# Altium schematic sheet camera.SchDoc
size A
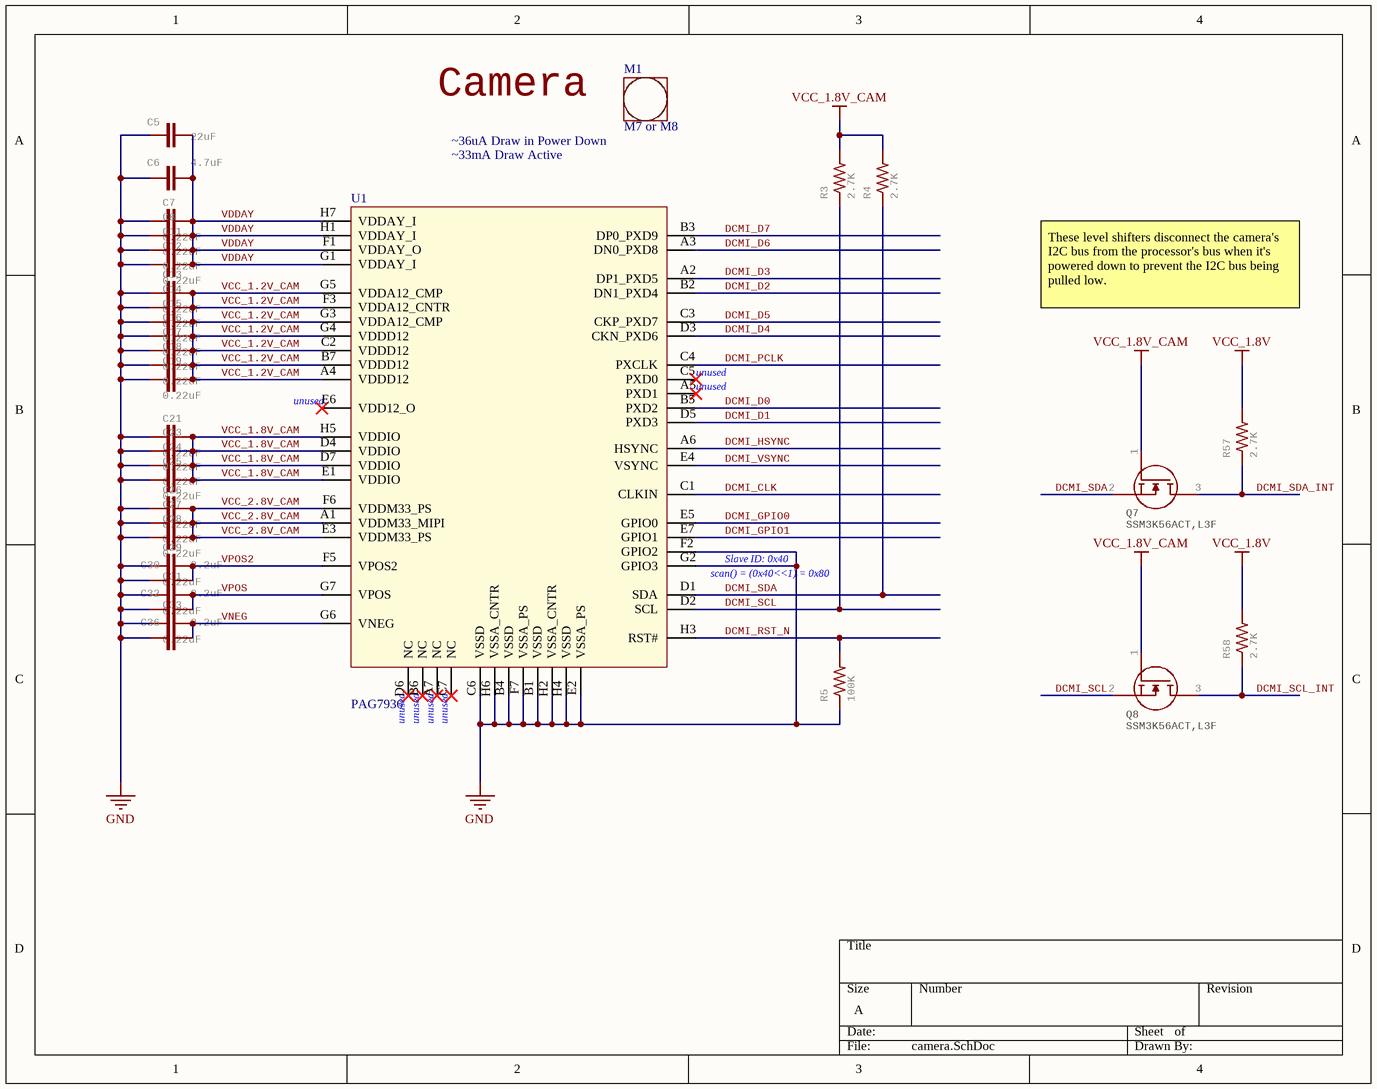
[diagram p0: camera.SchDoc]

## Parts
C5  22uF  [0805]
C6  4.7uF  [0402-CAP]
C7  0.22uF  [C0201]
C8  0.22uF  [C0201]
C11  0.22uF  [C0201]
C12  0.22uF  [C0201]
C13  0.22uF  [C0201]
C14  0.22uF  [C0201]
C15  0.22uF  [C0201]
C16  0.22uF  [C0201]
C17  0.22uF  [C0201]
C18  0.22uF  [C0201]
C19  0.22uF  [C0201]
C21  0.22uF  [C0201]
C23  0.22uF  [C0201]
C24  0.22uF  [C0201]
C25  0.22uF  [C0201]
C26  0.22uF  [C0201]
C27  0.22uF  [C0201]
C28  0.22uF  [C0201]
C29  0.22uF  [C0201]
C30  2.2uF  [0402-CAP]
C31  0.22uF  [C0201]
C32  2.2uF  [0402-CAP]
C33  0.22uF  [C0201]
C36  2.2uF  [0402-CAP]
M1  M7 or M8  [M7_M8]
Q7  MPN: SSM3K56ACT,L3F  [DFN1006]  (hidden comment: NMOS)
Q8  MPN: SSM3K56ACT,L3F  [DFN1006]  (hidden comment: NMOS)
R3  2.7K  [R0201]
R4  2.7K  [R0201]
R5  100K  [R0201]
R57  2.7K  [R0201]
R58  2.7K  [R0201]
U1  PAG7936  [PAG7936]

## Nets
GND: C5.1 C6.1 C7.1 C8.1 C11.1 C12.1 C13.1 C14.1 C15.1 C16.1 C17.1 C18.1 C19.1 C21.1 C23.1 C24.1 C25.1 C26.1 C27.1 C28.1 C29.1 C30.1 C31.1 C32.1 C33.1 C36.1 R5.1 U1.B1(VSSD) U1.B4(VSSD) U1.C6(VSSD) U1.E2(VSSA_PS) U1.F2(GPIO2) U1.F7(VSSA_PS) U1.G2(GPIO3) U1.H2(VSSA_CNTR) U1.H4(VSSD) U1.H6(VSSA_CNTR)
VCC_1.8V: R57.2 R58.2
VCC_1.8V_CAM: C21.2 C23.2 C24.2 C25.2 Q7.1(G) Q8.1(G) R3.2 R4.2 U1.D4(VDDIO) U1.D7(VDDIO) U1.E1(VDDIO) U1.H5(VDDIO)
DCMI_CLK: U1.C1(CLKIN)
DCMI_D0: U1.B5(PXD2)
DCMI_D1: U1.D5(PXD3)
DCMI_D2: U1.B2(DN1_PXD4)
DCMI_D3: U1.A2(DP1_PXD5)
DCMI_D4: U1.D3(CKN_PXD6)
DCMI_D5: U1.C3(CKP_PXD7)
DCMI_D6: U1.A3(DN0_PXD8)
DCMI_D7: U1.B3(DP0_PXD9)
DCMI_GPIO0: U1.E5(GPIO0)
DCMI_GPIO1: U1.E7(GPIO1)
DCMI_HSYNC: U1.A6(HSYNC)
DCMI_PCLK: U1.C4(PXCLK)
DCMI_RST_N: R5.2 U1.H3(RST#)
DCMI_SCL: Q8.2(S) R3.1 U1.D2(SCL)
DCMI_SCL_INT: Q8.3(D) R58.1
DCMI_SDA: Q7.2(S) R4.1 U1.D1(SDA)
DCMI_SDA_INT: Q7.3(D) R57.1
DCMI_VSYNC: U1.E4(VSYNC)
VCC_1.2V_CAM: C13.2 C14.2 C15.2 C16.2 C17.2 C18.2 C19.2 U1.A4(VDDD12) U1.B7(VDDD12) U1.C2(VDDD12) U1.F3(VDDA12_CNTR) U1.G3(VDDA12_CMP) U1.G4(VDDD12) U1.G5(VDDA12_CMP)
VCC_2.8V_CAM: C26.2 C27.2 C28.2 U1.A1(VDDM33_MIPI) U1.E3(VDDM33_PS) U1.F6(VDDM33_PS)
VDDAY: C5.2 C6.2 C7.2 C8.2 C11.2 C12.2 U1.F1(VDDAY_O) U1.G1(VDDAY_I) U1.H1(VDDAY_I) U1.H7(VDDAY_I)
VNEG: C33.2 C36.2 U1.G6(VNEG)
VPOS: C31.2 C32.2 U1.G7(VPOS)
VPOS2: C29.2 C30.2 U1.F5(VPOS2)

Not connected (* = marked no-connect by the designer): U1 A5(PXD1)* A7(NC)* B6(NC)* C5(PXD0)* C7(NC)* D6(NC)* E6(VDD12_O)*

## Notes on the sheet
- Camera
- (near M1) ~36uA Draw in Power Down
- ~33mA Draw Active
- These level shifters disconnect the camera's I2C bus from the processor's bus when it's powered down to prevent the I2C bus being pulled low.
- (near U1) unused
- (near U1) scan() = (0x40<<1) = 0x80
- Slave ID: 0x40

## Library data of the parts
C5 = 22UF-0805-6.3V-20%: 22ÂµF ceramic capacitors    A capacitor is a passive two-terminal electrical component used to store electrical energy temporarily in an electric field.; MPN: CL21A226MQQNNNE; GateName_1: G$1; SymbolName_1: CAP; PROD_ID: CAP-08402; DeviceName: -0805-6.3V-20%; LibraryName: SparkFun-Capacitors; DeviceSetName: 22UF
C6 = CAP_0402: 0402 (1005 Metric) Nick Garner - TeleSense; MPN: JMK105BBJ475MV-F; GateName_1: G$1; SymbolName_1: CAP; LibraryName: 0402; DeviceSetName: CAP_0402
C7 C8 C11-C19 C21 C23-C29 C31 C33 = C-EUC0201: CAPACITOR, European symbol; MPN: GRM033R60J224ME15D; GateName_1: G$1; SymbolName_1: C-EU; POPULARITY: 0; DeviceName: C0201; LibraryName: rcl; DeviceSetName: C-EU; SPICEPREFIX: C; Part Number: GRM033R60J224ME15D
C30 C32 C36 = CAP_0402: 0402 (1005 Metric) Nick Garner - TeleSense; MPN: CL05A225MQ5NNNC; GateName_1: G$1; SymbolName_1: CAP; LibraryName: 0402; DeviceSetName: CAP_0402
M1 = M7_M8_LENS_MOUNT
R3 R4 R57 R58 = RESISTOR0402-RES: MPN: RC0201JR-072K7L; GateName_1: G$1; SymbolName_1: RESISTOR; LibraryName: sfe; DeviceSetName: RESISTOR; Part Number: RC0201JR-072K7L
R5 = RESISTOR0402-RES: MPN: RMCF0201FT100K; GateName_1: G$1; SymbolName_1: RESISTOR; LibraryName: sfe; DeviceSetName: RESISTOR; Part Number: RMCF0201FT100K
U1 = PAG7936: MF: PixArt; MPN: PAG7936
Q7 Q8 = NMOS: Part Number: SSM3K56ACT,L3F